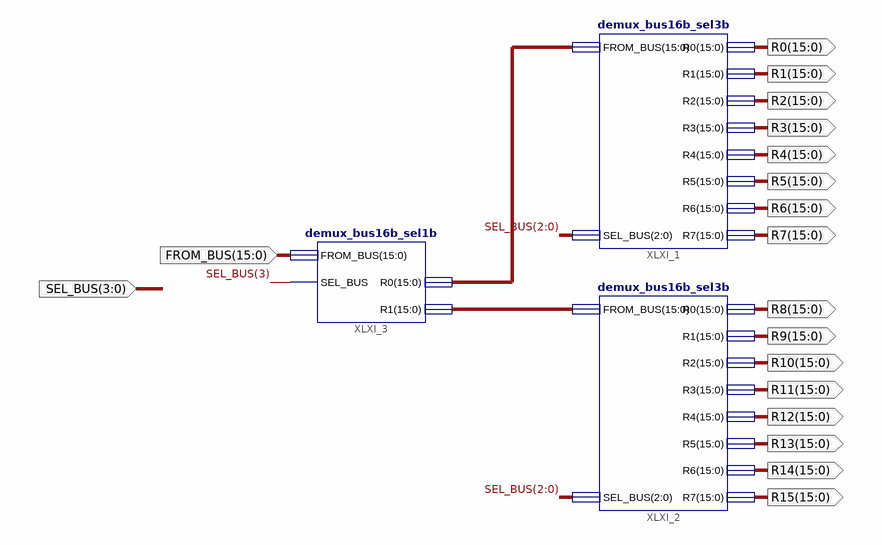
[diagram p0: schematic sheet 1]
// Xilinx ISE schematic demux_bus16b_sel4b.sch (artix7) as structural Verilog: 3 symbols, 18 ports
module demux_bus16b_sel4b (
  input  [15:0] FROM_BUS,
  input  [3:0] SEL_BUS,
  output [15:0] R0,
  output [15:0] R1,
  output [15:0] R2,
  output [15:0] R3,
  output [15:0] R4,
  output [15:0] R5,
  output [15:0] R6,
  output [15:0] R7,
  output [15:0] R8,
  output [15:0] R9,
  output [15:0] R10,
  output [15:0] R11,
  output [15:0] R12,
  output [15:0] R13,
  output [15:0] R14,
  output [15:0] R15
);

  wire [15:0] XLXN_1, XLXN_3;

  demux_bus16b_sel3b XLXI_1 (
    .FROM_BUS(XLXN_1), .SEL_BUS(SEL_BUS[2:0]), .R0(R0), .R1(R1), .R2(R2), .R3(R3), .R4(R4), .R5(R5), .R6(R6),
    .R7(R7));
  demux_bus16b_sel3b XLXI_2 (
    .FROM_BUS(XLXN_3), .SEL_BUS(SEL_BUS[2:0]), .R0(R8), .R1(R9), .R2(R10), .R3(R11), .R4(R12), .R5(R13),
    .R6(R14), .R7(R15));
  demux_bus16b_sel1b XLXI_3 (.SEL_BUS(SEL_BUS[3]), .FROM_BUS(FROM_BUS), .R0(XLXN_1), .R1(XLXN_3));
endmodule
